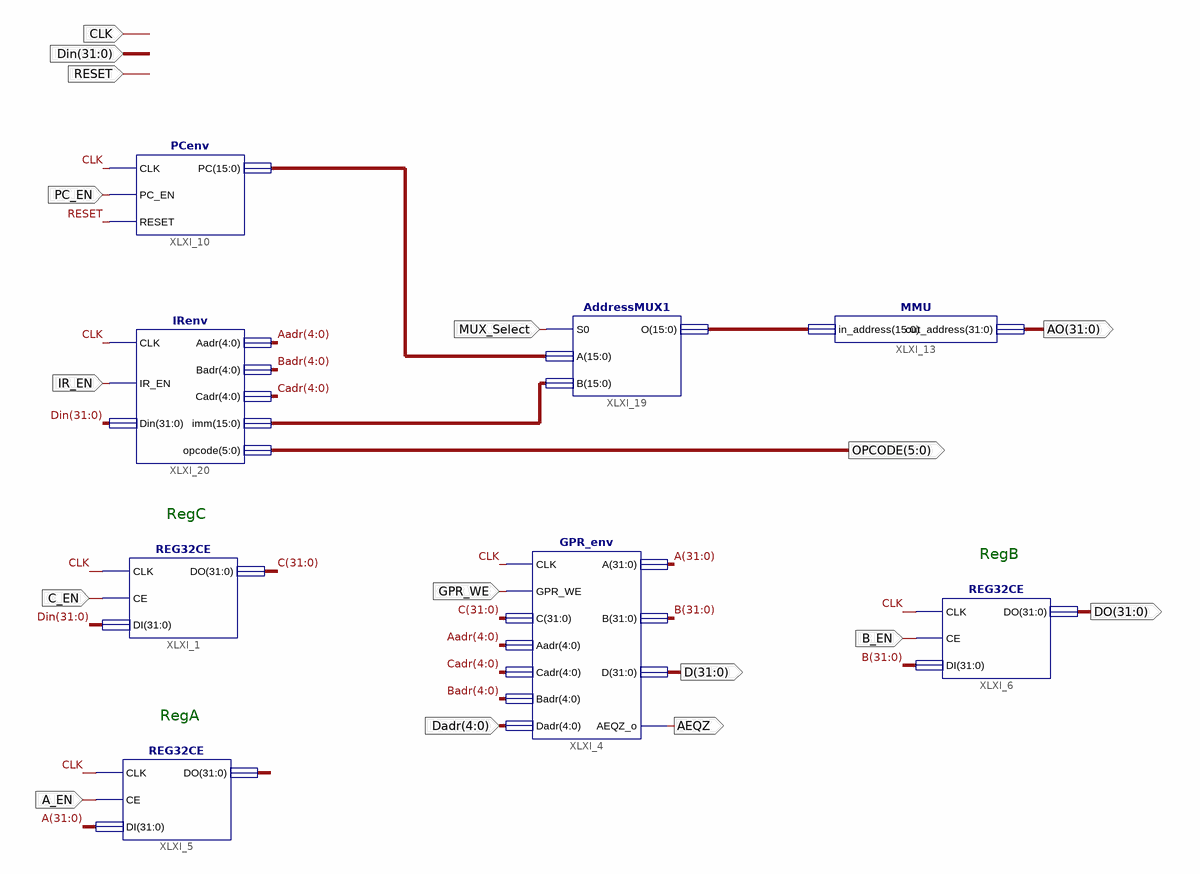
[diagram p0: schematic sheet 1]
// Xilinx ISE schematic Data_Path6.sch (spartan6) as structural Verilog: 8 symbols, 16 ports
module Data_Path6 (
  input  CLK,
  input  [31:0] Din,
  input  RESET,
  input  IR_EN,
  input  PC_EN,
  input  MUX_Select,
  input  [4:0] Dadr,
  input  GPR_WE,
  input  B_EN,
  input  A_EN,
  input  C_EN,
  output [31:0] AO,
  output AEQZ,
  output [31:0] D,
  output [31:0] DO,
  output [5:0] OPCODE
);

  wire [4:0] Aadr, Badr, Cadr;
  wire [15:0] imm, XLXN_37, XLXN_39;
  wire [31:0] A, B, C, XLXN_23;

  PCenv XLXI_10 (.CLK(CLK), .PC_EN(PC_EN), .RESET(RESET), .PC(XLXN_37));
  MMU XLXI_13 (.in_address(XLXN_39), .out_address(AO));
  AddressMUX1 XLXI_19 (.S0(MUX_Select), .A(XLXN_37), .B(imm), .O(XLXN_39));
  GPR_env XLXI_4 (
    .CLK(CLK), .GPR_WE(GPR_WE), .C(C), .Aadr(Aadr), .Cadr(Cadr), .Badr(Badr), .Dadr(Dadr), .A(A), .B(B),
    .D(D), .AEQZ_o(AEQZ));
  REG32CE XLXI_6 (.CLK(CLK), .CE(B_EN), .DI(B), .DO(DO));
  IRenv XLXI_20 (
    .CLK(CLK), .IR_EN(IR_EN), .Din(Din), .Aadr(Aadr), .Badr(Badr), .Cadr(Cadr), .imm(imm), .opcode(OPCODE));
  REG32CE XLXI_5 (.CLK(CLK), .CE(A_EN), .DI(A), .DO(XLXN_23));
  REG32CE XLXI_1 (.CLK(CLK), .CE(C_EN), .DI(Din), .DO(C));

  // Notes on the sheet:
  //   RegC
  //   RegB
  //   RegA
endmodule
